# Altium schematic sheet 09_RF_Loopback.SchDoc: Loopback
size A3; Organization: Lime Microsystems; Address1: Surrey Tech Centre; Address2: Guildford GU2 7YG; Address3: Surrey; Address4: United Kingdom; Revision: v1.2; SheetNumber: 9; SheetTotal: 27
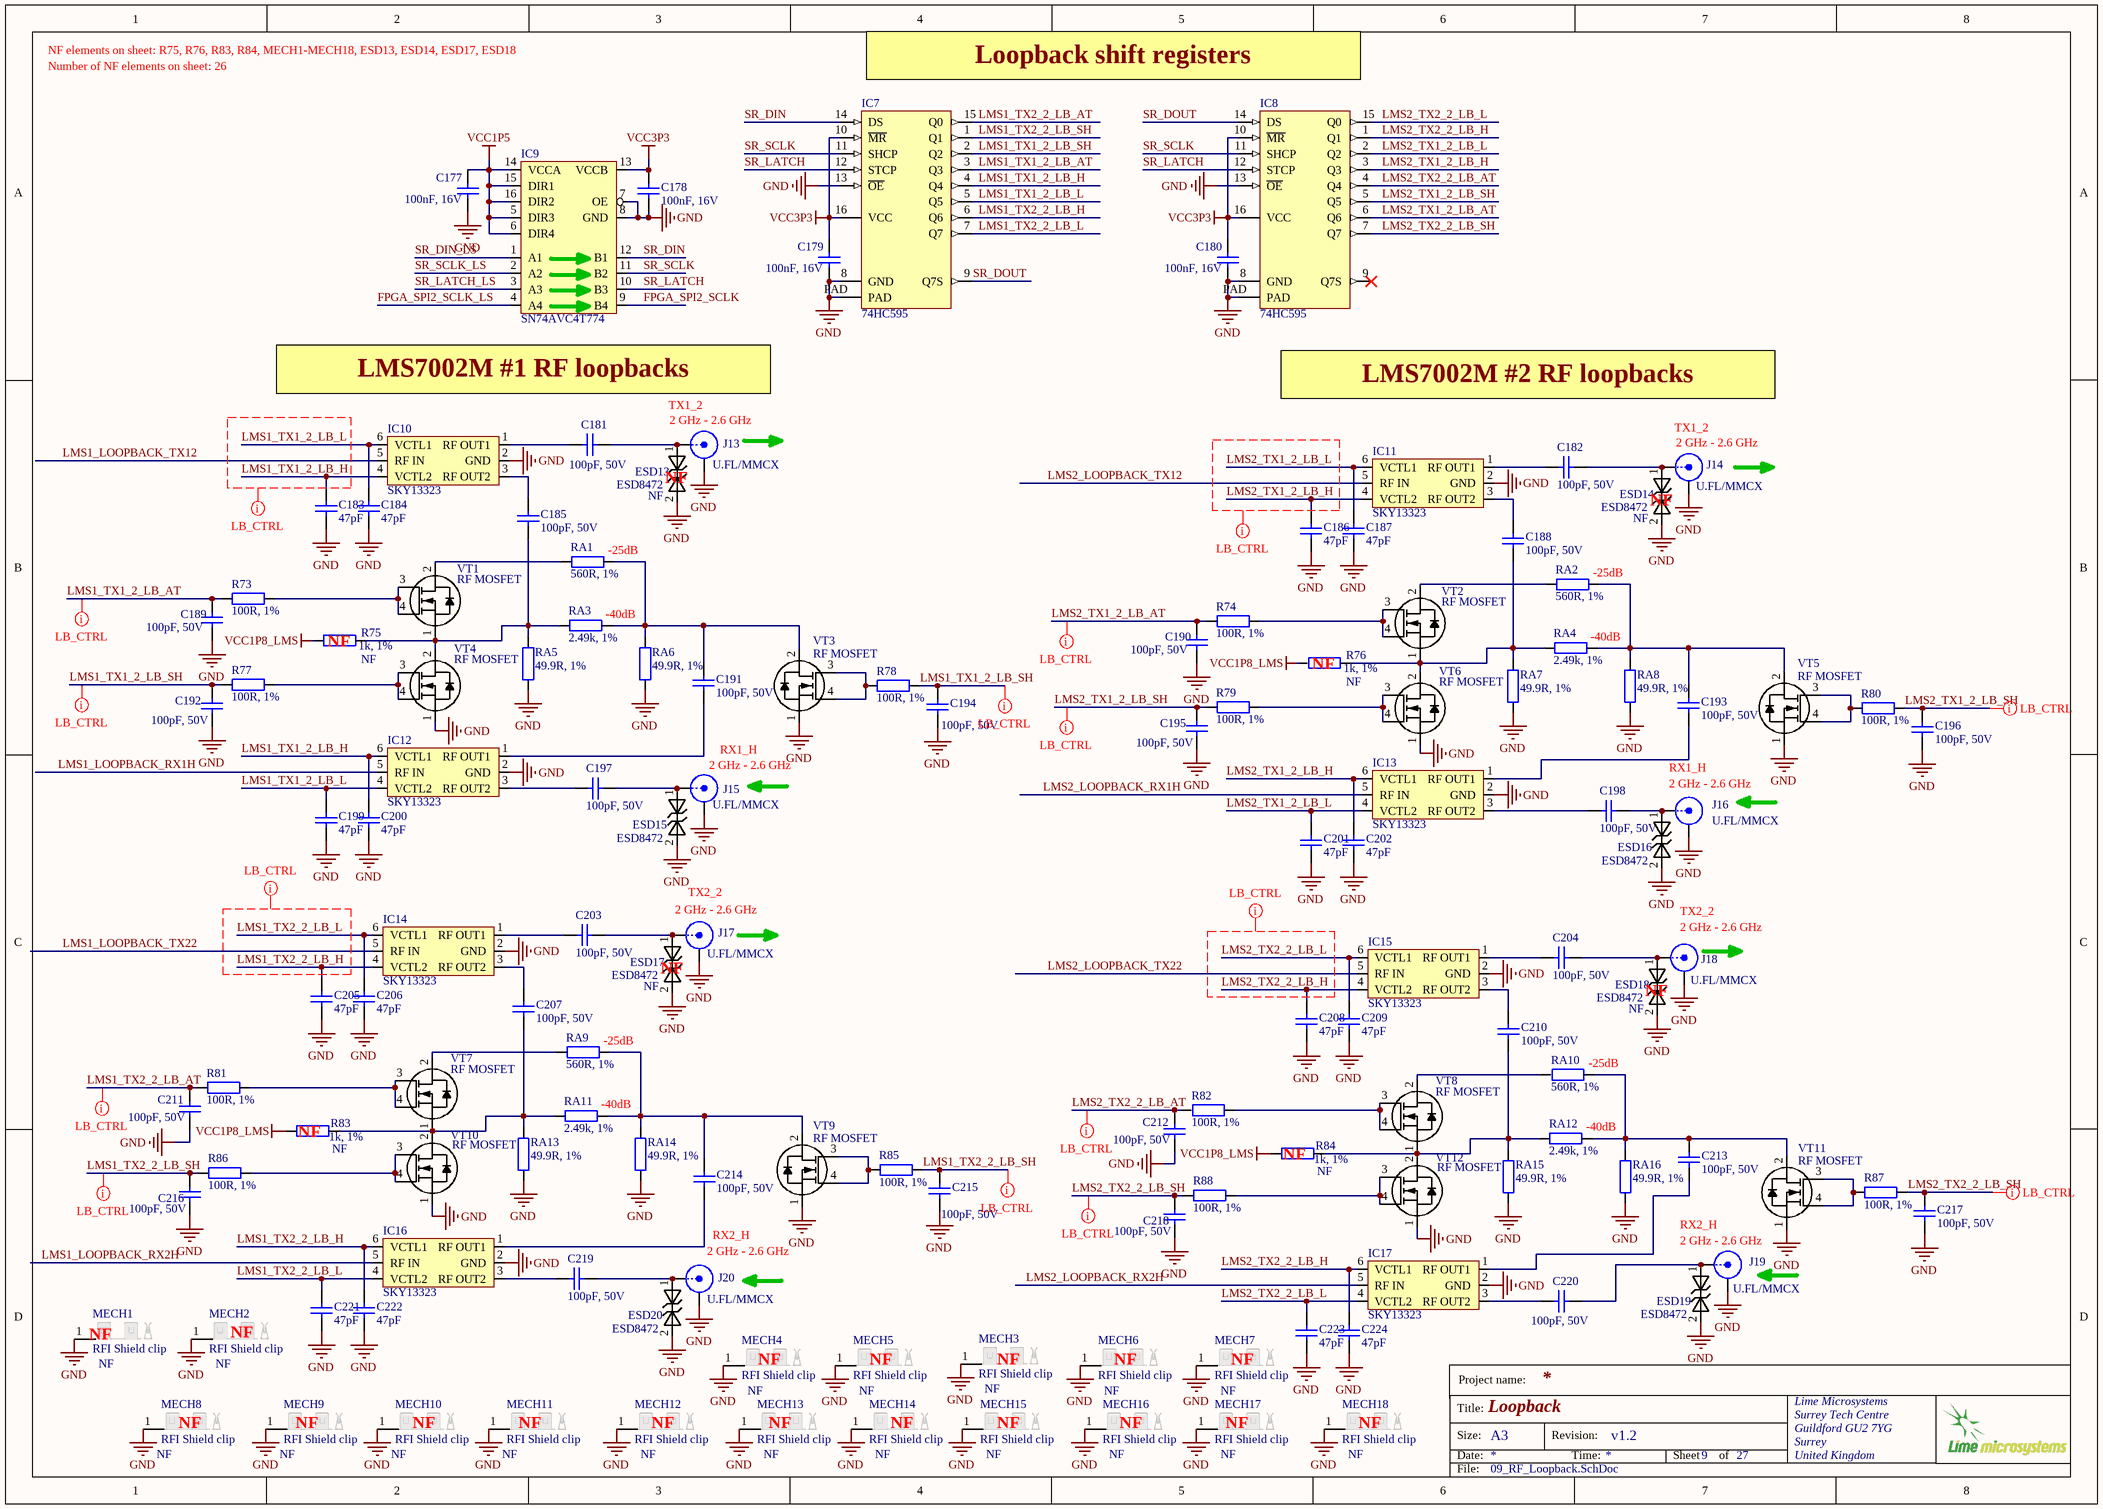
[diagram p0: 09_RF_Loopback.SchDoc]

## Parts
C177  100nF, 16V  [CAP0402]
C178  100nF, 16V  [CAP0402]
C179  100nF, 16V  [CAP0402]
C180  100nF, 16V  [CAP0402]
C181  100pF, 50V  [CAP0402]
C182  100pF, 50V  [CAP0402]
C183  47pF  [CAP0402]
C184  47pF  [CAP0402]
C185  100pF, 50V  [CAP0402]
C186  47pF  [CAP0402]
C187  47pF  [CAP0402]
C188  100pF, 50V  [CAP0402]
C189  100pF, 50V  [CAP0402]
C190  100pF, 50V  [CAP0402]
C191  100pF, 50V  [CAP0402]
C192  100pF, 50V  [CAP0402]
C193  100pF, 50V  [CAP0402]
C194  100pF, 50V  [CAP0402]
C195  100pF, 50V  [CAP0402]
C196  100pF, 50V  [CAP0402]
C197  100pF, 50V  [CAP0402]
C198  100pF, 50V  [CAP0402]
C199  47pF  [CAP0402]
C200  47pF  [CAP0402]
C201  47pF  [CAP0402]
C202  47pF  [CAP0402]
C203  100pF, 50V  [CAP0402]
C204  100pF, 50V  [CAP0402]
C205  47pF  [CAP0402]
C206  47pF  [CAP0402]
C207  100pF, 50V  [CAP0402]
C208  47pF  [CAP0402]
C209  47pF  [CAP0402]
C210  100pF, 50V  [CAP0402]
C211  100pF, 50V  [CAP0402]
C212  100pF, 50V  [CAP0402]
C213  100pF, 50V  [CAP0402]
C214  100pF, 50V  [CAP0402]
C215  100pF, 50V  [CAP0402]
C216  100pF, 50V  [CAP0402]
C217  100pF, 50V  [CAP0402]
C218  100pF, 50V  [CAP0402]
C219  100pF, 50V  [CAP0402]
C220  100pF, 50V  [CAP0402]
C221  47pF  [CAP0402]
C222  47pF  [CAP0402]
C223  47pF  [CAP0402]
C224  47pF  [CAP0402]
ESD13  ESD8472  Assembly Info: NF  [ESD8472_X3DFN2]
ESD14  ESD8472  Assembly Info: NF  [ESD8472_X3DFN2]
ESD15  ESD8472  [ESD8472_X3DFN2]
ESD16  ESD8472  [ESD8472_X3DFN2]
ESD17  ESD8472  Assembly Info: NF  [ESD8472_X3DFN2]
ESD18  ESD8472  Assembly Info: NF  [ESD8472_X3DFN2]
ESD19  ESD8472  [ESD8472_X3DFN2]
ESD20  ESD8472  [ESD8472_X3DFN2]
IC7  74HC595  [74HC595BQ,115]
IC8  74HC595  [74HC595BQ,115]
IC9  SN74AVC4T774  [SN74AVC4T774]
IC10  SKY13323  [SKY13323-378LF]
IC11  SKY13323  [SKY13323-378LF]
IC12  SKY13323  [SKY13323-378LF]
IC13  SKY13323  [SKY13323-378LF]
IC14  SKY13323  [SKY13323-378LF]
IC15  SKY13323  [SKY13323-378LF]
IC16  SKY13323  [SKY13323-378LF]
IC17  SKY13323  [SKY13323-378LF]
J13  U.FL/MMCX  [MMCX_UFL_conn_u]
J14  U.FL/MMCX  [MMCX_UFL_conn_u]
J15  U.FL/MMCX  [MMCX_UFL_conn_u]
J16  U.FL/MMCX  [MMCX_UFL_conn_u]
J17  U.FL/MMCX  [MMCX_UFL_conn_u]
J18  U.FL/MMCX  [MMCX_UFL_conn_u]
J19  U.FL/MMCX  [MMCX_UFL_conn_u]
J20  U.FL/MMCX  [MMCX_UFL_conn_u]
MECH1  RFI Shield clip  Assembly Info: NF  [RFI_SHIELD_CLPS_MINI]
MECH2  RFI Shield clip  Assembly Info: NF  [RFI_SHIELD_CLPS_MINI]
MECH3  RFI Shield clip  Assembly Info: NF  [RFI_SHIELD_CLPS_MINI]
MECH4  RFI Shield clip  Assembly Info: NF  [RFI_SHIELD_CLPS_MINI]
MECH5  RFI Shield clip  Assembly Info: NF  [RFI_SHIELD_CLPS_MINI]
MECH6  RFI Shield clip  Assembly Info: NF  [RFI_SHIELD_CLPS_MINI]
MECH7  RFI Shield clip  Assembly Info: NF  [RFI_SHIELD_CLPS_MINI]
MECH8  RFI Shield clip  Assembly Info: NF  [RFI_SHIELD_CLPS_MINI]
MECH9  RFI Shield clip  Assembly Info: NF  [RFI_SHIELD_CLPS_MINI]
MECH10  RFI Shield clip  Assembly Info: NF  [RFI_SHIELD_CLPS_MINI]
MECH11  RFI Shield clip  Assembly Info: NF  [RFI_SHIELD_CLPS_MINI]
MECH12  RFI Shield clip  Assembly Info: NF  [RFI_SHIELD_CLPS_MINI]
MECH13  RFI Shield clip  Assembly Info: NF  [RFI_SHIELD_CLPS_MINI]
MECH14  RFI Shield clip  Assembly Info: NF  [RFI_SHIELD_CLPS_MINI]
MECH15  RFI Shield clip  Assembly Info: NF  [RFI_SHIELD_CLPS_MINI]
MECH16  RFI Shield clip  Assembly Info: NF  [RFI_SHIELD_CLPS_MINI]
MECH17  RFI Shield clip  Assembly Info: NF  [RFI_SHIELD_CLPS_MINI]
MECH18  RFI Shield clip  Assembly Info: NF  [RFI_SHIELD_CLPS_MINI]
R73  100R, 1%  [RES0402]
R74  100R, 1%  [RES0402]
R75  1k, 1%  Assembly Info: NF  [RES0402]
R76  1k, 1%  Assembly Info: NF  [RES0402]
R77  100R, 1%  [RES0402]
R78  100R, 1%  [RES0402]
R79  100R, 1%  [RES0402]
R80  100R, 1%  [RES0402]
R81  100R, 1%  [RES0402]
R82  100R, 1%  [RES0402]
R83  1k, 1%  Assembly Info: NF  [RES0402]
R84  1k, 1%  Assembly Info: NF  [RES0402]
R85  100R, 1%  [RES0402]
R86  100R, 1%  [RES0402]
R87  100R, 1%  [RES0402]
R88  100R, 1%  [RES0402]
RA1  560R, 1%  [RES0402]
RA2  560R, 1%  [RES0402]
RA3  2.49k, 1%  [RES0402]
RA4  2.49k, 1%  [RES0402]
RA5  49.9R, 1%  [RES0402]
RA6  49.9R, 1%  [RES0402]
RA7  49.9R, 1%  [RES0402]
RA8  49.9R, 1%  [RES0402]
RA9  560R, 1%  [RES0402]
RA10  560R, 1%  [RES0402]
RA11  2.49k, 1%  [RES0402]
RA12  2.49k, 1%  [RES0402]
RA13  49.9R, 1%  [RES0402]
RA14  49.9R, 1%  [RES0402]
RA15  49.9R, 1%  [RES0402]
RA16  49.9R, 1%  [RES0402]
VT1  RF MOSFET  [BF1105R_SOT143R4]
VT2  RF MOSFET  [BF1105R_SOT143R4]
VT3  RF MOSFET  [BF1105R_SOT143R4]
VT4  RF MOSFET  [BF1105R_SOT143R4]
VT5  RF MOSFET  [BF1105R_SOT143R4]
VT6  RF MOSFET  [BF1105R_SOT143R4]
VT7  RF MOSFET  [BF1105R_SOT143R4]
VT8  RF MOSFET  [BF1105R_SOT143R4]
VT9  RF MOSFET  [BF1105R_SOT143R4]
VT10  RF MOSFET  [BF1105R_SOT143R4]
VT11  RF MOSFET  [BF1105R_SOT143R4]
VT12  RF MOSFET  [BF1105R_SOT143R4]

## Nets
GND: C177.1 C178.1 C179.1 C180.1 C183.1 C184.1 C186.1 C187.1 C189.2 C190.2 C192.2 C194.2 C195.2 C196.2 C199.1 C200.1 C201.1 C202.1 C205.1 C206.1 C208.1 C209.1 C211.2 C212.2 C215.2 C216.2 C217.2 C218.2 C221.1 C222.1 C223.1 C224.1 ESD13.2 ESD14.2 ESD15.2 ESD16.2 ESD17.2 ESD18.2 ESD19.2 ESD20.2 IC7.8(GND) IC7.13(~{OE}) IC7.PAD IC8.8(GND) IC8.13(~{OE}) IC8.PAD IC9.7(OE) IC9.8(GND) IC10.2(GND) IC11.2(GND) IC12.2(GND) IC13.2(GND) IC14.2(GND) IC15.2(GND) IC16.2(GND) IC17.2(GND) J13.2(Y) J14.2(Y) J15.2(Y) J16.2(Y) J17.2(Y) J18.2(Y) J19.2(Y) J20.2(Y) MECH1.1(GND) MECH2.1(GND) MECH3.1(GND) MECH4.1(GND) MECH5.1(GND) MECH6.1(GND) MECH7.1(GND) MECH8.1(GND) MECH9.1(GND) MECH10.1(GND) MECH11.1(GND) MECH12.1(GND) MECH13.1(GND) MECH14.1(GND) MECH15.1(GND) MECH16.1(GND) MECH17.1(GND) MECH18.1(GND) RA5.1 RA6.1 RA7.1 RA8.1 RA13.1 RA14.1 RA15.1 RA16.1 VT3.1(S) VT4.1(S) VT5.1(S) VT6.1(S) VT9.1(S) VT10.1(S) VT11.1(S) VT12.1(S)
VCC1P5: C177.2 IC9.5(DIR3) IC9.6(DIR4) IC9.14(VCCA) IC9.15(DIR1) IC9.16(DIR2)
VCC1P8_LMS: R75.2 R76.2 R83.2 R84.2
VCC3P3: C178.2 C179.2 C180.2 IC7.10(~{MR}) IC7.16(VCC) IC8.10(~{MR}) IC8.16(VCC) IC9.13(VCCB)
FPGA_SPI2_SCLK: IC9.9(B4)
FPGA_SPI2_SCLK_LS: IC9.4(A4)
LMS1_LOOPBACK_RX1H: IC12.5(RF_IN)
LMS1_LOOPBACK_RX2H: IC16.5(RF_IN)
LMS1_LOOPBACK_TX12: IC10.5(RF_IN)
LMS1_LOOPBACK_TX22: IC14.5(RF_IN)
LMS1_TX1_2_LB_AT: C189.1 IC7.3(Q3) R73.2
LMS1_TX1_2_LB_H: C183.2 C200.2 IC7.4(Q4) IC10.4(VCTL2) IC12.6(VCTL1)
LMS1_TX1_2_LB_L: C184.2 C199.2 IC7.5(Q5) IC10.6(VCTL1) IC12.4(VCTL2)
LMS1_TX1_2_LB_SH: C192.1 C194.1 IC7.2(Q2) R77.2 R78.1
LMS1_TX2_2_LB_AT: C211.1 IC7.15(Q0) R81.2
LMS1_TX2_2_LB_H: C205.2 C222.2 IC7.6(Q6) IC14.4(VCTL2) IC16.6(VCTL1)
LMS1_TX2_2_LB_L: C206.2 C221.2 IC7.7(Q7) IC14.6(VCTL1) IC16.4(VCTL2)
LMS1_TX2_2_LB_SH: C215.1 C216.1 IC7.1(Q1) R85.1 R86.2
LMS2_LOOPBACK_RX1H: IC13.5(RF_IN)
LMS2_LOOPBACK_RX2H: IC17.5(RF_IN)
LMS2_LOOPBACK_TX12: IC11.5(RF_IN)
LMS2_LOOPBACK_TX22: IC15.5(RF_IN)
LMS2_TX1_2_LB_AT: C190.1 IC8.6(Q6) R74.2
LMS2_TX1_2_LB_H: C186.2 C202.2 IC8.3(Q3) IC11.4(VCTL2) IC13.6(VCTL1)
LMS2_TX1_2_LB_L: C187.2 C201.2 IC8.2(Q2) IC11.6(VCTL1) IC13.4(VCTL2)
LMS2_TX1_2_LB_SH: C195.1 C196.1 IC8.5(Q5) R79.2 R80.1
LMS2_TX2_2_LB_AT: C212.1 IC8.4(Q4) R82.2
LMS2_TX2_2_LB_H: C208.2 C224.2 IC8.1(Q1) IC15.4(VCTL2) IC17.6(VCTL1)
LMS2_TX2_2_LB_L: C209.2 C223.2 IC8.15(Q0) IC15.6(VCTL1) IC17.4(VCTL2)
LMS2_TX2_2_LB_SH: C217.1 C218.1 IC8.7(Q7) R87.1 R88.2
SR_DIN: IC7.14(DS) IC9.12(B1)
SR_DIN_LS: IC9.1(A1)
SR_DOUT: IC7.9(Q7S) IC8.14(DS)
SR_LATCH: IC7.12(STCP) IC8.12(STCP) IC9.10(B3)
SR_LATCH_LS: IC9.3(A3)
SR_SCLK: IC7.11(SHCP) IC8.11(SHCP) IC9.11(B2)
SR_SCLK_LS: IC9.2(A2)
NetC181_1: C181.1 ESD13.1 J13.1(X)
NetC181_2: C181.2 IC10.1(RF_OUT1)
NetC182_1: C182.1 ESD14.1 J14.1(X)
NetC182_2: C182.2 IC11.1(RF_OUT1)
NetC185_1: C185.1 IC10.3(RF_OUT2)
NetC185_2: C185.2 R75.1 RA3.1 RA5.2 VT1.1(S) VT4.2(D)
NetC188_1: C188.1 IC11.3(RF_OUT2)
NetC188_2: C188.2 R76.1 RA4.1 RA7.2 VT2.1(S) VT6.2(D)
NetC191_1: C191.1 RA1.1 RA3.2 RA6.2 VT3.2(D)
NetC191_2: C191.2 IC12.1(RF_OUT1)
NetC193_1: C193.1 RA2.1 RA4.2 RA8.2 VT5.2(D)
NetC193_2: C193.2 IC13.1(RF_OUT1)
NetC197_1: C197.1 ESD15.1 J15.1(X)
NetC197_2: C197.2 IC12.3(RF_OUT2)
NetC198_1: C198.1 ESD16.1 J16.1(X)
NetC198_2: C198.2 IC13.3(RF_OUT2)
NetC203_1: C203.1 ESD17.1 J17.1(X)
NetC203_2: C203.2 IC14.1(RF_OUT1)
NetC204_1: C204.1 ESD18.1 J18.1(X)
NetC204_2: C204.2 IC15.1(RF_OUT1)
NetC207_1: C207.1 IC14.3(RF_OUT2)
NetC207_2: C207.2 R83.1 RA11.1 RA13.2 VT7.1(S) VT10.2(D)
NetC210_1: C210.1 IC15.3(RF_OUT2)
NetC210_2: C210.2 R84.1 RA12.1 RA15.2 VT8.1(S) VT12.2(D)
NetC213_1: C213.1 RA10.1 RA12.2 RA16.2 VT11.2(D)
NetC213_2: C213.2 IC17.1(RF_OUT1)
NetC214_1: C214.1 RA9.1 RA11.2 RA14.2 VT9.2(D)
NetC214_2: C214.2 IC16.1(RF_OUT1)
NetC219_1: C219.1 ESD20.1 J20.1(X)
NetC219_2: C219.2 IC16.3(RF_OUT2)
NetC220_1: C220.1 ESD19.1 J19.1(X)
NetC220_2: C220.2 IC17.3(RF_OUT2)
NetR73_1: R73.1 VT1.3(G2) VT1.4(G1)
NetR74_1: R74.1 VT2.3(G2) VT2.4(G1)
NetR77_1: R77.1 VT4.3(G2) VT4.4(G1)
NetR78_2: R78.2 VT3.3(G2) VT3.4(G1)
NetR79_1: R79.1 VT6.3(G2) VT6.4(G1)
NetR80_2: R80.2 VT5.3(G2) VT5.4(G1)
NetR81_1: R81.1 VT7.3(G2) VT7.4(G1)
NetR82_1: R82.1 VT8.3(G2) VT8.4(G1)
NetR85_2: R85.2 VT9.3(G2) VT9.4(G1)
NetR86_1: R86.1 VT10.3(G2) VT10.4(G1)
NetR87_2: R87.2 VT11.3(G2) VT11.4(G1)
NetR88_1: R88.1 VT12.3(G2) VT12.4(G1)
NetRA1_2: RA1.2 VT1.2(D)
NetRA2_2: RA2.2 VT2.2(D)
NetRA9_2: RA9.2 VT7.2(D)
NetRA10_2: RA10.2 VT8.2(D)

Not connected (* = marked no-connect by the designer): IC8 9(Q7S)*

## Layout directives
net class LB_CTRL: LMS1_TX1_2_LB_AT, LMS1_TX1_2_LB_H, LMS1_TX1_2_LB_L, LMS1_TX1_2_LB_SH, LMS1_TX2_2_LB_AT, LMS1_TX2_2_LB_H, LMS1_TX2_2_LB_L, LMS1_TX2_2_LB_SH, LMS2_TX1_2_LB_AT, LMS2_TX1_2_LB_H, LMS2_TX1_2_LB_L, LMS2_TX1_2_LB_SH, LMS2_TX2_2_LB_AT, LMS2_TX2_2_LB_H, LMS2_TX2_2_LB_L, LMS2_TX2_2_LB_SH

## Notes on the sheet
- NF elements on sheet: R75, R76, R83, R84, MECH1-MECH18, ESD13, ESD14, ESD17, ESD18
- Number of NF elements on sheet: 26
- Loopback shift registers
- LMS7002M #1 RF loopbacks
- TX1_2
- 2 GHz - 2.6 GHz
- LMS7002M #2 RF loopbacks
- (near J14) 2 GHz - 2.6 GHz
- (near ESD13) NF
- (near ESD14) NF
- (near RA1) -25dB
- (near RA2) -25dB
- (near R75) NF
- (near RA3) -40dB
- (near RA4) -40dB
- (near R76) NF
- (near J15) 2 GHz - 2.6 GHz
- RX1_H
- TX2_2
- (near ESD17) NF
- (near J18) 2 GHz - 2.6 GHz
- (near RA9) -25dB
- (near ESD18) NF
- (near RA11) -40dB
- (near RA10) -25dB
- (near R83) NF
- (near R84) NF
- (near RA12) -40dB
- (near J20) 2 GHz - 2.6 GHz
- RX2_H
- (near MECH1) NF
- (near MECH2) NF
- (near MECH4) NF
- (near MECH5) NF
- (near MECH3) NF
- (near MECH6) NF
- (near MECH7) NF
- (near MECH8) NF
- (near MECH9) NF
- (near MECH10) NF
- (near MECH11) NF
- (near MECH12) NF
- (near MECH13) NF
- (near MECH14) NF
- (near MECH15) NF
- (near MECH16) NF
- (near MECH17) NF
- (near MECH18) NF
- Project name:
- Title:
- Size:
- Date:
- A3
- Revision:
- Time:
- Sheet
- of
- File:

## Library data of the parts
C177-C180 = Cap_0402: Manufacturer: Murata Electronics; Manufacturer Part Number: GRM155R71C104KA88D; Part Description: 0.10µF ±10% 16V Ceramic Capacitor X7R 0402 (1005 Metric); Tolerance: 10 %; Type: General Purpose MLCC; Capacitance: 0.1 uF; Case Length: 1 mm; Dielectric: X7R; Case Height: 0.5 mm; Temperature Coefficient / Code: +/- 15 %; Value: 100nF, 16V; Supplier 1: Mouser; Supplier Part Number 1: 81-GRM155R71C104KA88; Case Code - in: 0402; RoHS: RoHS Compliant; Operating Temperature Range: - 55 C to + 125 C; Series: GRM; Termination Style: SMD/SMT; Package / Case: 0402 (1005 metric); Voltage Rating DC: 16 V; Maximum Operating Temperature: + 125 C; Case Code - mm: 1005; Minimum Operating Temperature: - 55 C; Product Category: Low & Medium Capacitance SMD Ceramic Chip Capacitors; Packaging: Reel; Product: General Type MLCCs; Category: Multilayer Ceramic Capacitors MLCC - SMD/SMT; Brand: Murata Electronics; Case Width: 0.5 mm; RoHS - Mouser: Y; Standard Pack Qty: 10000; Minimum Order Quantity: 1; Reeling: True; Manufacturer Part Number 1: GRM155R71C104KA88D
C181 C182 C185 C188-C198 C203 C204 C207 C210-C220 = Cap_0402: Manufacturer Part Number 1: CC0402JRNPO9BN101; Manufacturer: Yageo; Part Description: 100pF ±5% 50V C0G, NP0 Ceramic Capacitor -55°C ~ 125°C Surface Mount, MLCC 0402 (1005 Metric) 0.039" L x 0.020" W (1.00mm x 0.50mm); Tolerance: ±5%; Temperature Coefficient: C0G, NP0; Value: 100pF, 50V; Capacitance: 100pF; Thickness (Max): 0.022" (0.55mm); Size / Dimension: 0.039" L x 0.020" W (1.00mm x 0.50mm); RoHS: RoHS Compliant; Ratings: -; Package / Case: 0402 (1005 Metric); Mounting Type: Surface Mount, MLCC; Height - Seated (Max): -; Features: -; Lead Spacing: -; Voltage - Rated: 50V; Operating Temperature: -55°C ~ 125°C; Packaging: Cut Tape (CT); Applications: General Purpose; Lead Style: -; Supplier 1: Digi-Key; Category: Capacitors; Supplier Part Number 1: 311-1024-1-ND
C183 C184 C186 C187 C199-C202 C205 C206 C208 C209 C221-C224 = Cap_0402: Manufacturer Part Number 1: C1005C0G1H470F050BA; Manufacturer: TDK Corporation; Part Description: 47pF ±1% 50V C0G, NP0 Ceramic Capacitor -55°C ~ 125°C Surface Mount, MLCC 0402 (1005 Metric) 0.039" L x 0.020" W (1.00mm x 0.50mm); Voltage - Rated: 50V; Temperature Coefficient: C0G, NP0; Tolerance: ±1%; Value: 47pF; Supplier 1: Digi-Key; Supplier Part Number 1: 445-5361-1-ND; Package / Case: 0402 (1005 Metric); Lead Spacing: -; Ratings: -; Mounting Type: Surface Mount, MLCC; Operating Temperature: -55°C ~ 125°C; Thickness (Max): 0.022" (0.55mm); Capacitance: 47pF; Packaging: Cut Tape (CT); Features: -; Applications: General Purpose; Lead Style: -; Size / Dimension: 0.039" L x 0.020" W (1.00mm x 0.50mm); Height - Seated (Max): -; RoHS: RoHS Compliant; Category: Capacitors
ESD13-ESD20 = ESD8472: Manufacturer: ON Semiconductor; Manufacturer Part Number: ESD8472MUT5G; Part Description: TVS DIODE 5.3VWM 14VC X3DFN2; Voltage - Reverse Standoff (Typ): 5.3V (Max); Voltage - Breakdown (Min): 7V; Voltage - Clamping (Max) @ Ipp: 14V; Current - Peak Pulse (10/1000µs): 3A (8/20µs); Power Line Protection: No; Capacitance @ Frequency: 0.2pF @ 1MHz; Supplier 1: Digi-Key; RoHS: RoHS Compliant; Category: Circuit Protection; Stock 1: 2295; Pricing 1: 1=0.39, 10=0.315, 100=0.2142, 500=0.16068, 1000=0.12051 (USD); Packaging: Cut Tape (CT); Part Status: Active; Type: Zener; Power - Peak Pulse: -; Applications: Automotive, RF Antenna; Operating Temperature: -55°C ~ 150°C (TJ); Mounting Type: Surface Mount; Package / Case: 2-XFDFN; Supplier Device Package: 2-X3DFN (0.62x0.32); ComponentLink1URL: http://www.onsemi.com/pub/Collateral/ESD8472-D.PDF; ComponentLink1Description: http://www.onsemi.com/pub/Collateral/ESD8472-D.PDF; Supplier Part Number 1: ESD8472MUT5GOSCT-ND
IC7 IC8 = 74HC595BQ,115: Part Description: C 8BIT SHIFT REGISTER 16-DHVQFN; Manufacturer: Nexperia USA Inc.; Logic Type: Shift Register; Output Type: Tri-State; Number of Bits per Element: 8; Function: Serial to Parallel, Serial; Voltage - Supply: 2 V ~ 6 V; Supplier 1: Digi-Key; Manufacturer Part Number 1: 74HC595BQ,115; RoHS: RoHS Compliant; Category: Integrated Circuits (ICs); Stock 1: 15449; Pricing 1: 1=0.39, 10=0.32, 100=0.2175, 500=0.16316, 1000=0.12236 (USD); Packaging: Cut Tape (CT); Part Status: Active; Operating Temperature: -40°C ~ 125°C; Mounting Type: Surface Mount; Package / Case: 16-VFQFN Exposed Pad; Supplier Device Package: 16-DHVQFN (2.5x3.5); ComponentLink1URL: http://assets.nexperia.com/documents/data-sheet/74HC_HCT595.pdf; ComponentLink1Description: http://assets.nexperia.com/documents/data-sheet/74HC_HCT595.pdf; Supplier Part Number 1: 1727-3327-1-ND
IC9 = SN74AVC4T774: Manufacturer: Texas Instruments; Manufacturer Part Number 1: SN74AVC4T774RSVR; Part Description: Voltage Level Translator Bidirectional 1 Circuit 4 Channel 380Mbps 16-UQFN (2.6x1.8); Logic Function: Translator, Bidirectional, 3-State; Differential - Input:Output: No/No; Propagation Delay (Max): 2.4ns; Number of Bits: 4; Number of Outputs/Channel: 1; Input Type: Logic; Voltage - Supply: 1.2 V ~ 3.6 V; Data Rate: 380Mbps; Supplier 1: Digi-Key; Supplier Device Package: 16-UQFN (2.6x1.8); Packaging: Digi-Reel®; Category: Integrated Circuits (ICs); Mounting Type: Surface Mount; RoHS: RoHS Compliant; Number of Channels: 4; Output Type: Logic; Package / Case: 16-UFQFN; Operating Temperature: -40°C ~ 85°C; Supplier Part Number 1: 296-24741-6-ND
IC10-IC17 = SKY13323: SKY13323-378LF: 0.1-3.0 GHz GaAs SPDT Switch; Manufacturer: Skyworks Solutions Inc.; Part Description: IC SPDT 100MHZ-3GHZ 6-MLPD; Frequency - Lower: 100MHz; P1dB: 27dBm (typ) IP1dB; Isolation @ Frequency: 27dB @ 3GHz (typ); RF Type: 802.11b/g; Impedance: 50 Ohm; IIP3: 50dBm (typ); Topology: Reflective; Insertion Loss @ Frequency: 0.35dB @ 3GHz; Frequency - Upper: 3GHz; Supplier 1: Digi-Key; Operating Temperature: -40°C ~ 85°C; RoHS: RoHS Compliant; Package / Case: 6-XFDFN Exposed Pad; Circuit: SPDT; Features: -; Supplier Device Package: 6-MLPD (1x1); Category: RF/IF and RFID; Packaging: Cut Tape (CT); Manufacturer Part Number 1: SKY13323-378LF; Supplier Part Number 1: 683-1334-1-ND
J13-J20 = RF_IF_connector: CONN UMC RCPT STR 50 OHM SMD; Manufacturer: Molex, LLC; Manufacturer Part Number 1: 0734120110; Part Description: Ultra Miniature Coaxial Connector Receptacle, Male Pin 50 Ohm Surface Mount Solder; Body Finish: Nickel; Body Material: Phosphor Bronze; Center Contact Material: Brass; Center Contact Plating: Gold; Connector Style: Ultra Miniature Coaxial; Connector Type: Jack, Male Pin; Contact Termination: Solder; Dielectric Material: Liquid Crystal Polymer (LCP); Frequency - Max: 6GHz; Impedance: 50 Ohm; Voltage Rating: 60V; Cable Group: -; Category: Connectors, Interconnects; Fastening Type: Snap-On; Features: -; Housing Color: Silver; Ingress Protection: -; Mounting Type: Surface Mount; Operating Temperature: -40°C ~ 90°C; Packaging: Cut Tape (CT); RoHS: RoHS Compliant; Shield Termination: Solder; Supplier 1: Digi-Key; Supplier Part Number 1: WM5587CT-ND
MECH1-MECH18 = RFI_SHIELD_CLIP: Manufacturer: HARWIN; Part Description: RFI SHIELD CLIP MINI TIN SMD; Manufacturer Part Number 1: S0971-46R; SVHC: No SVHC (15-Jun-2015); Supplier 1: Farnell; Supplier: Farnell; Length: 5.8; Clip Type: RFI Shield Clip; Clip Diameter: -; Product Range: -; Mounting Hole Dia: -; RoHS: YES; Supplier Part Number 1: 2361677
R73 R74 R77-R82 R85-R88 = Res_0402: Manufacturer Part Number 1: RMCF0402FT100R; Part Description: RES SMD 100 OHM 1% 1/16W 0402; Manufacturer: Stackpole Electronics Inc.; Temperature Coefficient: ±100ppm/°C; Supplier 1: Digi-Key; Supplier Part Number 1: RMCF0402FT100RDKR-ND; Package / Case: 0402 (1005 Metric); Composition: Thick Film; Category: Resistors; Tolerance: ±1%; Value: 100R, 1%
R75 R76 R83 R84 = Res_0402: Manufacturer: Stackpole Electronics Inc; Manufacturer Part Number 1: RMCF0402FT1K00; Part Description: RES SMD 1K OHM 1% 1/16W 0402; Temperature Coefficient: ±100ppm/°C; Power (Watts): 0.063W, 1/16W; Value: 1k, 1%; Supplier 1: Digi-Key; Supplier Part Number 1: RMCF0402FT1K00TR-ND; Resistance (Ohms): 1k; Packaging: Tape & Reel (TR); Category: Resistors; RoHS: RoHS Compliant; Tolerance: ±1%; Height: 0.016" (0.40mm); Number of Terminations: 2; Package / Case: 0402 (1005 Metric); Operating Temperature: -55°C ~ 155°C; Features: -; Composition: Thick Film; Supplier Device Package: 0402; Size / Dimension: 0.039" L x 0.020" W (1.00mm x 0.50mm)
RA1 RA2 RA9 RA10 = Res_0402: Manufacturer Part Number: CRCW0402560RFKED; Manufacturer: Vishay Dale; Part Description: RES SMD 560 OHM 1% 1/16W 0402; Resistance (Ohms): 560; Power (Watts): 0.063W, 1/16W; Temperature Coefficient: ±100ppm/°C; RoHS: RoHS Compliant; Packaging: Cut Tape (CT); Composition: Thick Film; Tolerance: ±1%; Number of Terminations: 2; Supplier Device Package: 0402 (1005 Metric); Operating Temperature: -55°C ~ 155°C; Features: Automotive AEC-Q200; Category: Resistors; Supplier Part Number 1: 541-560LCT-ND; Package / Case: 0402 (1005 Metric); Supplier 1: Digi-Key; Height: 0.016" (0.40mm); Size / Dimension: 0.039" L x 0.020" W (1.00mm x 0.50mm)
RA3 RA4 RA11 RA12 = Res_0402: Manufacturer Part Number: RC0402FR-072K49L; Manufacturer: Yageo; Part Description: RES SMD 2.49K OHM 1% 1/16W 0402; Temperature Coefficient: ±100ppm/°C; Power (Watts): 0.063W, 1/16W; Value: 2.49k, 1%; Size / Dimension: 0.039" L x 0.020" W (1.00mm x 0.50mm); Height: 0.016" (0.40mm); Features: Moisture Resistant; Resistance (Ohms): 2.49k; Operating Temperature: -55°C ~ 155°C; Tolerance: ±1%; Composition: Thick Film; Supplier Device Package: 0402; Package / Case: 0402 (1005 Metric); Number of Terminations: 2; Category: Resistors; Packaging: Digi-Reel®; Supplier Part Number 1: 311-2.49KLRDKR-ND; RoHS: RoHS Compliant; Supplier 1: Digi-Key
RA5-RA8 RA13-RA16 = Res_0402: Manufacturer: Samsung Electro-Mechanics America, Inc.; Manufacturer Part Number: RC1005F49R9CS; Part Description: RES SMD 49.9 OHM 1% 1/16W 0402; Temperature Coefficient: ±100ppm/°C; Resistance (Ohms): 49.9; Power (Watts): 0.063W, 1/16W; Number of Terminations: 2; Size / Dimension: 0.039" L x 0.020" W (1.00mm x 0.50mm); Supplier Device Package: 0402 (1005 Metric); RoHS: RoHS Compliant; Supplier Part Number 1: 1276-3469-6-ND; Features: -; Packaging: Digi-Reel®; Tolerance: ±1%; Height: 0.016" (0.40mm); Category: Resistors; Composition: Thick Film; Package / Case: 0402 (1005 Metric); Supplier 1: Digi-Key; Operating Temperature: -55°C ~ 155°C; Value: 49.9R, 1%
VT1-VT12 = BF1105R,215: Manufacturer: NXP Semiconductors; Part Description: RF MOSFET Transistors Trans MOSFET N-CH 7V 0.03A 4pin(3+Tab); Voltage - Rated: 7V; Noise Figure: 1.7dB; Current Rating: 30mA; Gain: 20dB; Transistor Type: N-Channel Dual Gate; Frequency: 800MHz; Voltage - Test: 5V; Supplier 1: Digi-Key; RoHS: RoHS Compliant; Supplier Device Package: SOT-143R; Power - Output: -; Current - Test: -; Manufacturer Part Number 1: BF1105R,215; Packaging: Digi-Reel®; Package / Case: SOT-143R; Category: Discrete Semiconductor Products; Supplier Part Number 1: 568-12530-6-ND